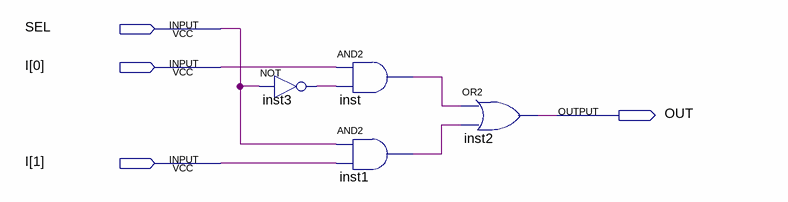
[diagram p0: schematic sheet]
// Quartus schematic MUX.bdf as structural Verilog: 4 symbols, 4 pins
module MUX (
  input  SEL,
  input  [1:0] I,
  output OUT
);

  wire inst1_out, inst3_out, inst_out;

  not inst3 (inst3_out, SEL);
  and inst (inst_out, I[0], inst3_out);
  and inst1 (inst1_out, SEL, I[1]);
  or inst2 (OUT, inst_out, inst1_out);
endmodule
